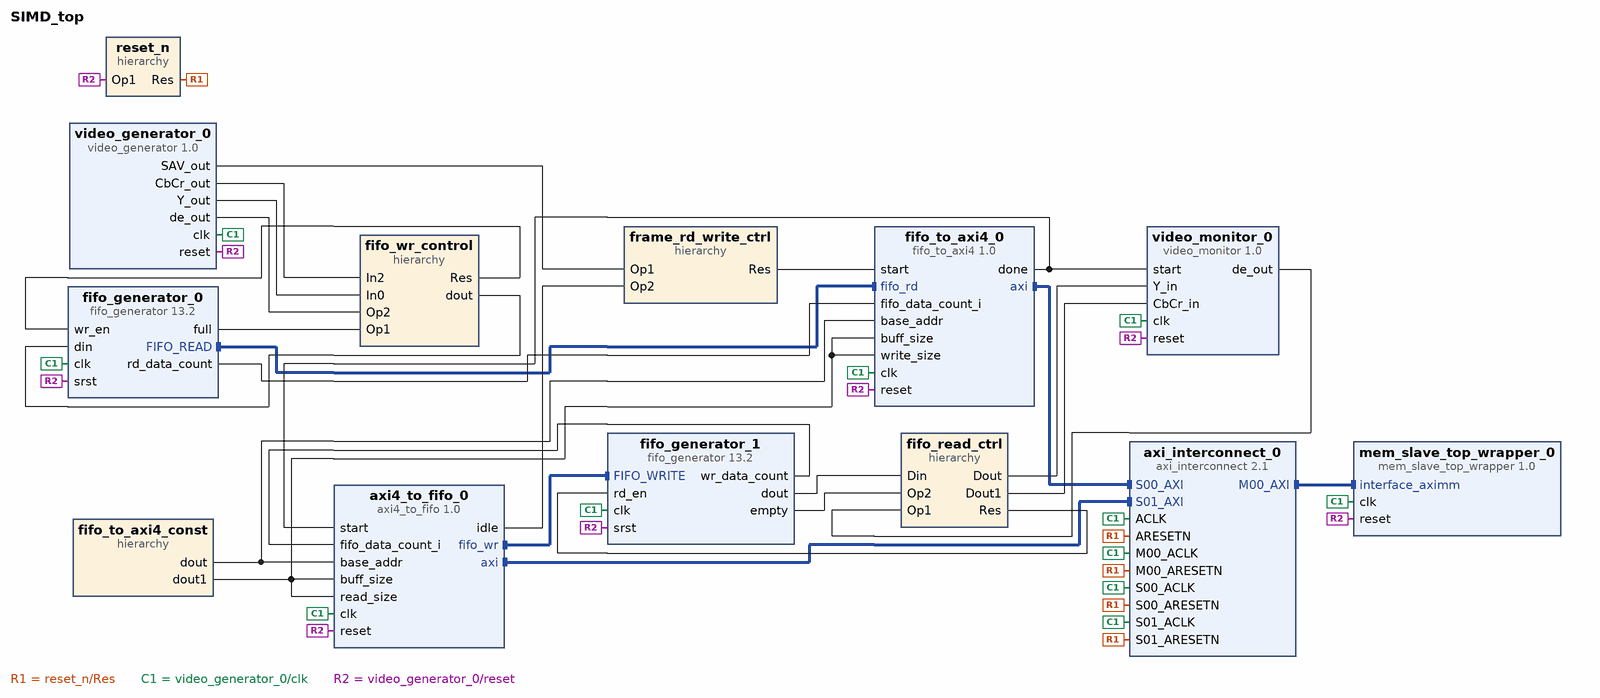
[diagram p0: block diagram of the top level]
# Vivado block design SIMD_top, xc7z045ffg900-2, Vivado 2018.2
create_bd_design SIMD_top

create_bd_cell -type ip -vlnv xilinx.com:user:axi4_to_fifo:1.0 axi4_to_fifo_0
create_bd_cell -type ip -vlnv xilinx.com:ip:axi_interconnect:2.1 axi_interconnect_0
set_property -dict {CONFIG.NUM_SI 2 CONFIG.NUM_MI 1} [get_bd_cells axi_interconnect_0]
create_bd_cell -type ip -vlnv xilinx.com:ip:fifo_generator:13.2 fifo_generator_0
set_property -dict [list \
  CONFIG.Performance_Options First_Word_Fall_Through \
  CONFIG.Input_Data_Width 32 \
  CONFIG.Input_Depth 1024 \
  CONFIG.Output_Data_Width 64 \
  CONFIG.Write_Data_Count true \
  CONFIG.Write_Data_Count_Width 11 \
  CONFIG.Read_Data_Count true \
  CONFIG.Read_Data_Count_Width 10 \
] [get_bd_cells fifo_generator_0]
create_bd_cell -type ip -vlnv xilinx.com:ip:fifo_generator:13.2 fifo_generator_1
set_property -dict [list \
  CONFIG.Performance_Options First_Word_Fall_Through \
  CONFIG.Input_Data_Width 64 \
  CONFIG.Input_Depth 512 \
  CONFIG.Output_Data_Width 32 \
  CONFIG.Write_Data_Count true \
  CONFIG.Write_Data_Count_Width 10 \
  CONFIG.Read_Data_Count true \
  CONFIG.Read_Data_Count_Width 11 \
] [get_bd_cells fifo_generator_1]
create_bd_cell -type hier fifo_read_ctrl
create_bd_cell -type ip -vlnv xilinx.com:user:fifo_to_axi4:1.0 fifo_to_axi4_0
create_bd_cell -type hier fifo_to_axi4_const
create_bd_cell -type hier fifo_wr_control
create_bd_cell -type hier frame_rd_write_ctrl
create_bd_cell -type ip -vlnv xilinx.com:user:mem_slave_top_wrapper:1.0 mem_slave_top_wrapper_0
set_property -dict {CONFIG.ADD_ID_WIDTH 5} [get_bd_cells mem_slave_top_wrapper_0]
create_bd_cell -type hier reset_n
create_bd_cell -type ip -vlnv xilinx.com:user:video_generator:1.0 video_generator_0
create_bd_cell -type ip -vlnv xilinx.com:user:video_monitor:1.0 video_monitor_0

# ---- hierarchy /fifo_read_ctrl ----
current_bd_instance /fifo_read_ctrl
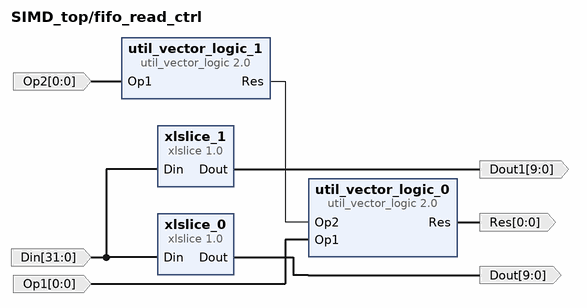
[diagram p1: block diagram inside /fifo_read_ctrl]
create_bd_pin -dir I -from 31 -to 0 Din
create_bd_pin -dir O -from 9 -to 0 Dout
create_bd_pin -dir O -from 9 -to 0 Dout1
create_bd_pin -dir I -from 0 -to 0 Op1
create_bd_pin -dir I -from 0 -to 0 Op2
create_bd_pin -dir O -from 0 -to 0 Res

create_bd_cell -type ip -vlnv xilinx.com:ip:util_vector_logic:2.0 util_vector_logic_0
set_property -dict {CONFIG.C_SIZE 1} [get_bd_cells util_vector_logic_0]
create_bd_cell -type ip -vlnv xilinx.com:ip:util_vector_logic:2.0 util_vector_logic_1
set_property -dict {CONFIG.C_SIZE 1 CONFIG.C_OPERATION not} [get_bd_cells util_vector_logic_1]
create_bd_cell -type ip -vlnv xilinx.com:ip:xlslice:1.0 xlslice_0
set_property -dict {CONFIG.DIN_FROM 9 CONFIG.DOUT_WIDTH 10} [get_bd_cells xlslice_0]
create_bd_cell -type ip -vlnv xilinx.com:ip:xlslice:1.0 xlslice_1
set_property -dict {CONFIG.DIN_TO 16 CONFIG.DIN_FROM 25 CONFIG.DOUT_WIDTH 10} [get_bd_cells xlslice_1]

# ---- hierarchy /fifo_to_axi4_const ----
current_bd_instance /fifo_to_axi4_const
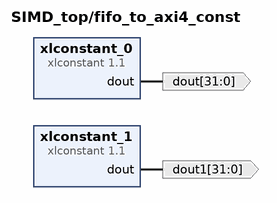
[diagram p2: block diagram inside /fifo_to_axi4_const]
create_bd_pin -dir O -from 31 -to 0 dout
create_bd_pin -dir O -from 31 -to 0 dout1

create_bd_cell -type ip -vlnv xilinx.com:ip:xlconstant:1.1 xlconstant_0
set_property -dict {CONFIG.CONST_WIDTH 32 CONFIG.CONST_VAL 0x00000000} [get_bd_cells xlconstant_0]
create_bd_cell -type ip -vlnv xilinx.com:ip:xlconstant:1.1 xlconstant_1
set_property -dict {CONFIG.CONST_WIDTH 32 CONFIG.CONST_VAL 8294400} [get_bd_cells xlconstant_1]

# ---- hierarchy /fifo_wr_control ----
current_bd_instance /fifo_wr_control
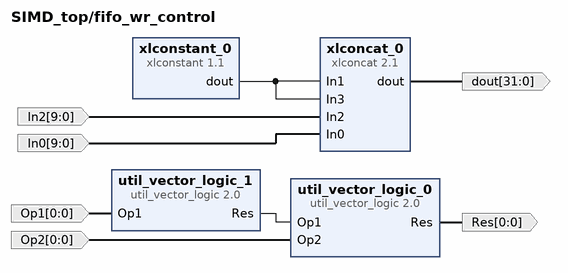
[diagram p3: block diagram inside /fifo_wr_control]
create_bd_pin -dir I -from 9 -to 0 In0
create_bd_pin -dir I -from 9 -to 0 In2
create_bd_pin -dir I -from 0 -to 0 Op1
create_bd_pin -dir I -from 0 -to 0 Op2
create_bd_pin -dir O -from 0 -to 0 Res
create_bd_pin -dir O -from 31 -to 0 dout

create_bd_cell -type ip -vlnv xilinx.com:ip:util_vector_logic:2.0 util_vector_logic_0
set_property -dict {CONFIG.C_SIZE 1} [get_bd_cells util_vector_logic_0]
create_bd_cell -type ip -vlnv xilinx.com:ip:util_vector_logic:2.0 util_vector_logic_1
set_property -dict {CONFIG.C_SIZE 1 CONFIG.C_OPERATION not} [get_bd_cells util_vector_logic_1]
create_bd_cell -type ip -vlnv xilinx.com:ip:xlconcat:2.1 xlconcat_0
set_property -dict [list \
  CONFIG.NUM_PORTS 4 \
  CONFIG.IN0_WIDTH 10 \
  CONFIG.IN1_WIDTH 6 \
  CONFIG.IN2_WIDTH 10 \
  CONFIG.IN3_WIDTH 6 \
  CONFIG.IN4_WIDTH 1 \
] [get_bd_cells xlconcat_0]
create_bd_cell -type ip -vlnv xilinx.com:ip:xlconstant:1.1 xlconstant_0
set_property -dict {CONFIG.CONST_WIDTH 6 CONFIG.CONST_VAL 0} [get_bd_cells xlconstant_0]

# ---- hierarchy /frame_rd_write_ctrl ----
current_bd_instance /frame_rd_write_ctrl
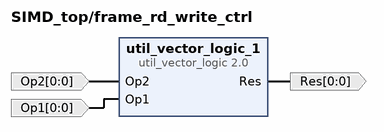
[diagram p4: block diagram inside /frame_rd_write_ctrl]
create_bd_pin -dir I -from 0 -to 0 Op1
create_bd_pin -dir I -from 0 -to 0 Op2
create_bd_pin -dir O -from 0 -to 0 Res

create_bd_cell -type ip -vlnv xilinx.com:ip:util_vector_logic:2.0 util_vector_logic_1
set_property -dict {CONFIG.C_SIZE 1} [get_bd_cells util_vector_logic_1]

# ---- hierarchy /reset_n ----
current_bd_instance /reset_n
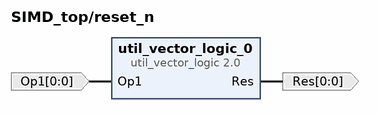
[diagram p5: block diagram inside /reset_n]
create_bd_pin -dir I -from 0 -to 0 Op1
create_bd_pin -dir O -from 0 -to 0 Res

create_bd_cell -type ip -vlnv xilinx.com:ip:util_vector_logic:2.0 util_vector_logic_0
set_property -dict {CONFIG.C_SIZE 1 CONFIG.C_OPERATION not} [get_bd_cells util_vector_logic_0]

# ---- connections ----

current_bd_instance /fifo_read_ctrl
connect_bd_net -net Op1_1 [get_bd_pins Op1] [get_bd_pins util_vector_logic_0/Op1]
connect_bd_net -net Op2_1 [get_bd_pins Op2] [get_bd_pins util_vector_logic_1/Op1]
connect_bd_net -net fifo_generator_1_dout [get_bd_pins Din] [get_bd_pins xlslice_0/Din] [get_bd_pins xlslice_1/Din]
connect_bd_net [get_bd_pins util_vector_logic_0/Res] [get_bd_pins Res]
connect_bd_net [get_bd_pins util_vector_logic_1/Res] [get_bd_pins util_vector_logic_0/Op2]
connect_bd_net [get_bd_pins xlslice_0/Dout] [get_bd_pins Dout]
connect_bd_net [get_bd_pins xlslice_1/Dout] [get_bd_pins Dout1]

current_bd_instance /fifo_to_axi4_const
connect_bd_net [get_bd_pins xlconstant_0/dout] [get_bd_pins dout]
connect_bd_net [get_bd_pins xlconstant_1/dout] [get_bd_pins dout1]

current_bd_instance /fifo_wr_control
connect_bd_net -net Op1_1 [get_bd_pins Op1] [get_bd_pins util_vector_logic_1/Op1]
connect_bd_net -net Op2_1 [get_bd_pins Op2] [get_bd_pins util_vector_logic_0/Op2]
connect_bd_net [get_bd_pins util_vector_logic_0/Res] [get_bd_pins Res]
connect_bd_net [get_bd_pins util_vector_logic_1/Res] [get_bd_pins util_vector_logic_0/Op1]
connect_bd_net -net video_generator_0_CbCr_out [get_bd_pins In2] [get_bd_pins xlconcat_0/In2]
connect_bd_net -net video_generator_0_Y_out [get_bd_pins In0] [get_bd_pins xlconcat_0/In0]
connect_bd_net [get_bd_pins xlconcat_0/dout] [get_bd_pins dout]
connect_bd_net [get_bd_pins xlconstant_0/dout] [get_bd_pins xlconcat_0/In1] [get_bd_pins xlconcat_0/In3]

current_bd_instance /frame_rd_write_ctrl
connect_bd_net -net axi4_to_fifo_0_idle [get_bd_pins Op2] [get_bd_pins util_vector_logic_1/Op2]
connect_bd_net [get_bd_pins util_vector_logic_1/Res] [get_bd_pins Res]
connect_bd_net -net video_generator_0_SAV_out [get_bd_pins Op1] [get_bd_pins util_vector_logic_1/Op1]

current_bd_instance /reset_n
connect_bd_net [get_bd_pins util_vector_logic_0/Res] [get_bd_pins Res]
connect_bd_net -net video_generator_0_reset [get_bd_pins Op1] [get_bd_pins util_vector_logic_0/Op1]

current_bd_instance /
connect_bd_intf_net [get_bd_intf_pins axi4_to_fifo_0/axi] [get_bd_intf_pins axi_interconnect_0/S01_AXI]
connect_bd_intf_net [get_bd_intf_pins axi4_to_fifo_0/fifo_wr] [get_bd_intf_pins fifo_generator_1/FIFO_WRITE]
connect_bd_intf_net [get_bd_intf_pins axi_interconnect_0/M00_AXI] [get_bd_intf_pins mem_slave_top_wrapper_0/interface_aximm]
connect_bd_intf_net [get_bd_intf_pins axi_interconnect_0/S00_AXI] [get_bd_intf_pins fifo_to_axi4_0/axi]
connect_bd_intf_net [get_bd_intf_pins fifo_generator_0/FIFO_READ] [get_bd_intf_pins fifo_to_axi4_0/fifo_rd]
connect_bd_net [get_bd_pins axi4_to_fifo_0/idle] [get_bd_pins frame_rd_write_ctrl/Op2]
connect_bd_net [get_bd_pins fifo_generator_0/full] [get_bd_pins fifo_wr_control/Op1]
connect_bd_net [get_bd_pins fifo_generator_0/rd_data_count] [get_bd_pins fifo_to_axi4_0/fifo_data_count_i]
connect_bd_net [get_bd_pins fifo_generator_1/dout] [get_bd_pins fifo_read_ctrl/Din]
connect_bd_net [get_bd_pins fifo_generator_1/empty] [get_bd_pins fifo_read_ctrl/Op2]
connect_bd_net [get_bd_pins fifo_generator_1/wr_data_count] [get_bd_pins axi4_to_fifo_0/fifo_data_count_i]
connect_bd_net [get_bd_pins fifo_read_ctrl/Res] [get_bd_pins fifo_generator_1/rd_en]
connect_bd_net [get_bd_pins fifo_to_axi4_0/done] [get_bd_pins axi4_to_fifo_0/start] [get_bd_pins video_monitor_0/start]
connect_bd_net [get_bd_pins fifo_wr_control/Res] [get_bd_pins fifo_generator_0/wr_en]
connect_bd_net [get_bd_pins fifo_wr_control/dout] [get_bd_pins fifo_generator_0/din]
connect_bd_net [get_bd_pins reset_n/Res] \
  [get_bd_pins axi_interconnect_0/ARESETN] [get_bd_pins axi_interconnect_0/M00_ARESETN] \
  [get_bd_pins axi_interconnect_0/S00_ARESETN] [get_bd_pins axi_interconnect_0/S01_ARESETN]
connect_bd_net -net util_vector_logic_1_Res [get_bd_pins frame_rd_write_ctrl/Res] [get_bd_pins fifo_to_axi4_0/start]
connect_bd_net [get_bd_pins video_generator_0/CbCr_out] [get_bd_pins fifo_wr_control/In2]
connect_bd_net [get_bd_pins video_generator_0/SAV_out] [get_bd_pins frame_rd_write_ctrl/Op1]
connect_bd_net [get_bd_pins video_generator_0/Y_out] [get_bd_pins fifo_wr_control/In0]
connect_bd_net [get_bd_pins video_generator_0/clk] \
  [get_bd_pins axi4_to_fifo_0/clk] [get_bd_pins fifo_generator_0/clk] [get_bd_pins fifo_generator_1/clk] \
  [get_bd_pins fifo_to_axi4_0/clk] [get_bd_pins mem_slave_top_wrapper_0/clk] [get_bd_pins video_monitor_0/clk] \
  [get_bd_pins axi_interconnect_0/ACLK] [get_bd_pins axi_interconnect_0/M00_ACLK] [get_bd_pins axi_interconnect_0/S00_ACLK] \
  [get_bd_pins axi_interconnect_0/S01_ACLK]
connect_bd_net [get_bd_pins video_generator_0/de_out] [get_bd_pins fifo_wr_control/Op2]
connect_bd_net [get_bd_pins video_generator_0/reset] \
  [get_bd_pins axi4_to_fifo_0/reset] [get_bd_pins fifo_generator_0/srst] [get_bd_pins fifo_generator_1/srst] \
  [get_bd_pins fifo_to_axi4_0/reset] [get_bd_pins mem_slave_top_wrapper_0/reset] [get_bd_pins video_monitor_0/reset] \
  [get_bd_pins reset_n/Op1]
connect_bd_net [get_bd_pins video_monitor_0/de_out] [get_bd_pins fifo_read_ctrl/Op1]
connect_bd_net -net xlconstant_0_dout [get_bd_pins fifo_to_axi4_const/dout] \
  [get_bd_pins axi4_to_fifo_0/base_addr] [get_bd_pins fifo_to_axi4_0/base_addr]
connect_bd_net -net xlconstant_1_dout [get_bd_pins fifo_to_axi4_const/dout1] \
  [get_bd_pins axi4_to_fifo_0/buff_size] [get_bd_pins axi4_to_fifo_0/read_size] [get_bd_pins fifo_to_axi4_0/buff_size] \
  [get_bd_pins fifo_to_axi4_0/write_size]
connect_bd_net -net xlslice_0_Dout [get_bd_pins fifo_read_ctrl/Dout] [get_bd_pins video_monitor_0/Y_in]
connect_bd_net -net xlslice_1_Dout [get_bd_pins fifo_read_ctrl/Dout1] [get_bd_pins video_monitor_0/CbCr_in]

# ---- address map ----
assign_bd_address -offset 0x00000000 -range 4G -target_address_space [get_bd_addr_spaces axi4_to_fifo_0/axi] [get_bd_addr_segs mem_slave_top_wrapper_0/interface_aximm/reg0]
assign_bd_address -offset 0x00000000 -range 4G -target_address_space [get_bd_addr_spaces fifo_to_axi4_0/axi] [get_bd_addr_segs mem_slave_top_wrapper_0/interface_aximm/reg0]

validate_bd_design
save_bd_design
